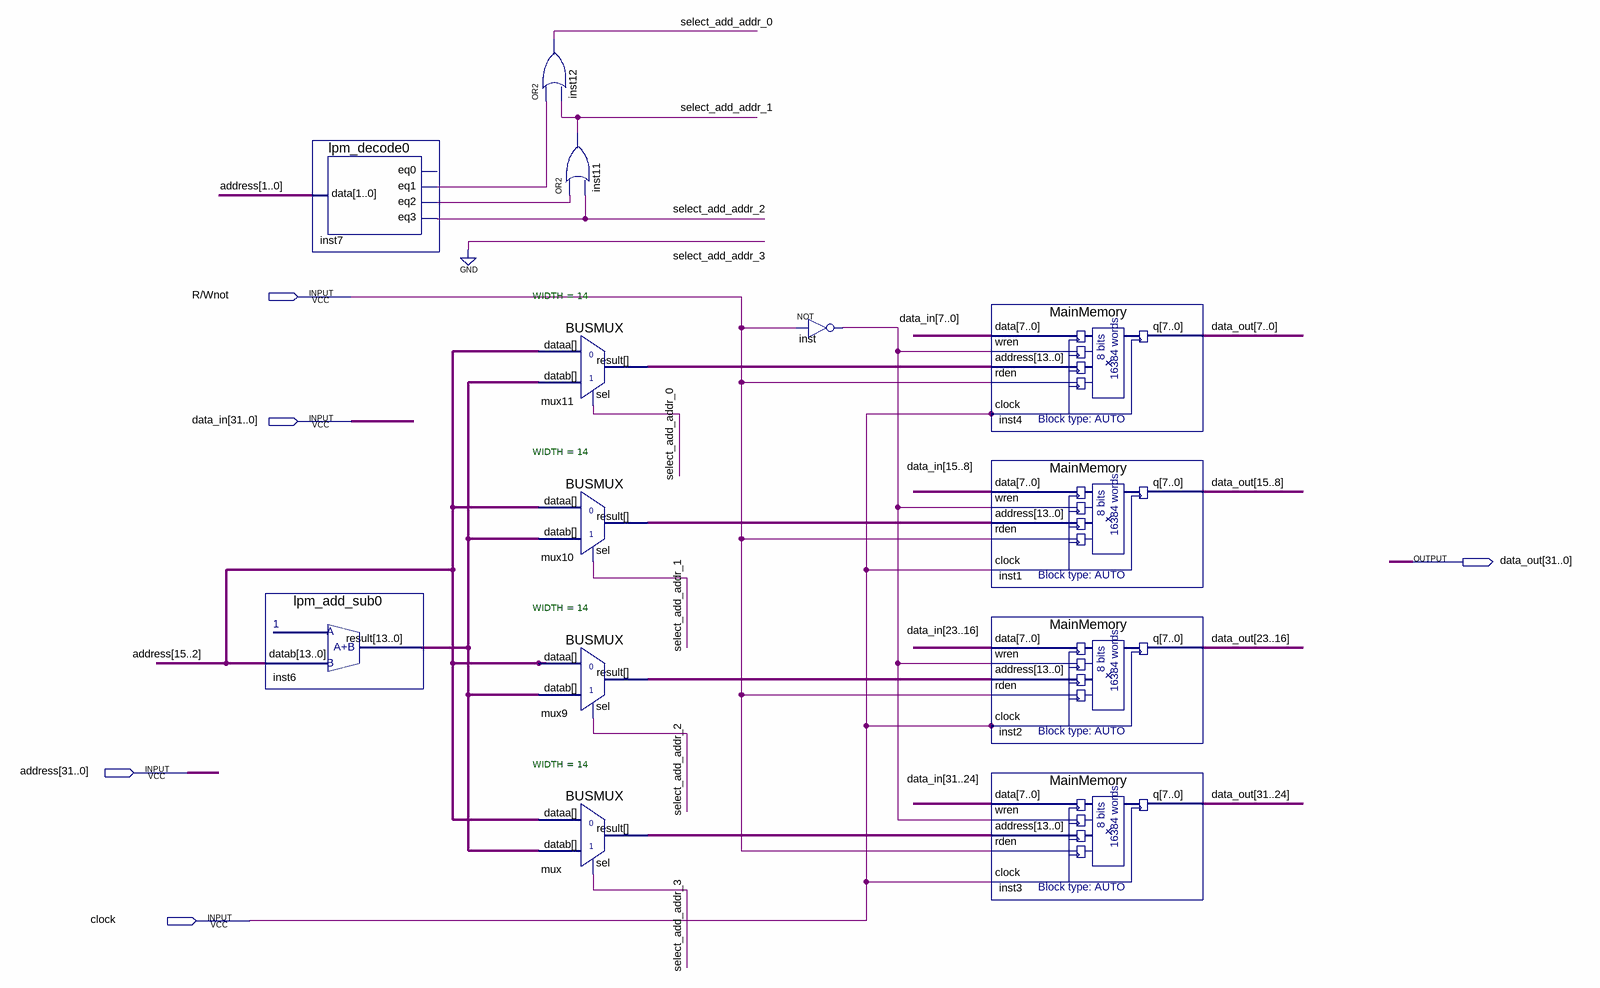
[diagram p0: schematic sheet]
// Quartus schematic memory.bdf as structural Verilog: 13 symbols, 5 pins
module memory (
  input  \R/Wnot ,
  input  [31:0] data_in,
  input  [31:0] address,
  input  clock,
  output [31:0] data_out
);

  wire inst7_eq1, inst7_eq2, inst_out, select_add_addr_0, select_add_addr_1, select_add_addr_2;
  wire [13:0] inst6_result, mux9_result, mux10_result, mux11_result, mux_result;

  lpm_add_sub0 inst6 (.datab(address[15:2]), .result(inst6_result));
  lpm_decode0 inst7 (.data(address[1:0]), .eq1(inst7_eq1), .eq2(inst7_eq2), .eq3(select_add_addr_2));  // open: eq0
  or inst12 (select_add_addr_0, inst7_eq1, select_add_addr_1);
  or inst11 (select_add_addr_1, inst7_eq2, select_add_addr_2);
  BUSMUX #(.WIDTH(14)) mux11 (
    .datab(inst6_result), .sel(select_add_addr_0), .dataa(address[15:2]), .result(mux11_result));
  BUSMUX #(.WIDTH(14)) mux10 (
    .datab(inst6_result), .sel(select_add_addr_1), .dataa(address[15:2]), .result(mux10_result));
  BUSMUX #(.WIDTH(14)) mux9 (
    .datab(inst6_result), .sel(select_add_addr_2), .dataa(address[15:2]), .result(mux9_result));
  BUSMUX #(.WIDTH(14)) mux (.datab(inst6_result), .sel(1'b0), .dataa(address[15:2]), .result(mux_result));
  not inst (inst_out, \R/Wnot );
  MainMemory inst4 (
    .data(data_in[7:0]), .wren(inst_out), .address(mux11_result), .rden(\R/Wnot ), .clock(clock),
    .q(data_out[7:0]));
  MainMemory inst1 (
    .data(data_in[15:8]), .wren(inst_out), .address(mux10_result), .rden(\R/Wnot ), .clock(clock),
    .q(data_out[15:8]));
  MainMemory inst2 (
    .data(data_in[23:16]), .wren(inst_out), .address(mux9_result), .rden(\R/Wnot ), .clock(clock),
    .q(data_out[23:16]));
  MainMemory inst3 (
    .data(data_in[31:24]), .wren(inst_out), .address(mux_result), .rden(\R/Wnot ), .clock(clock),
    .q(data_out[31:24]));
endmodule
